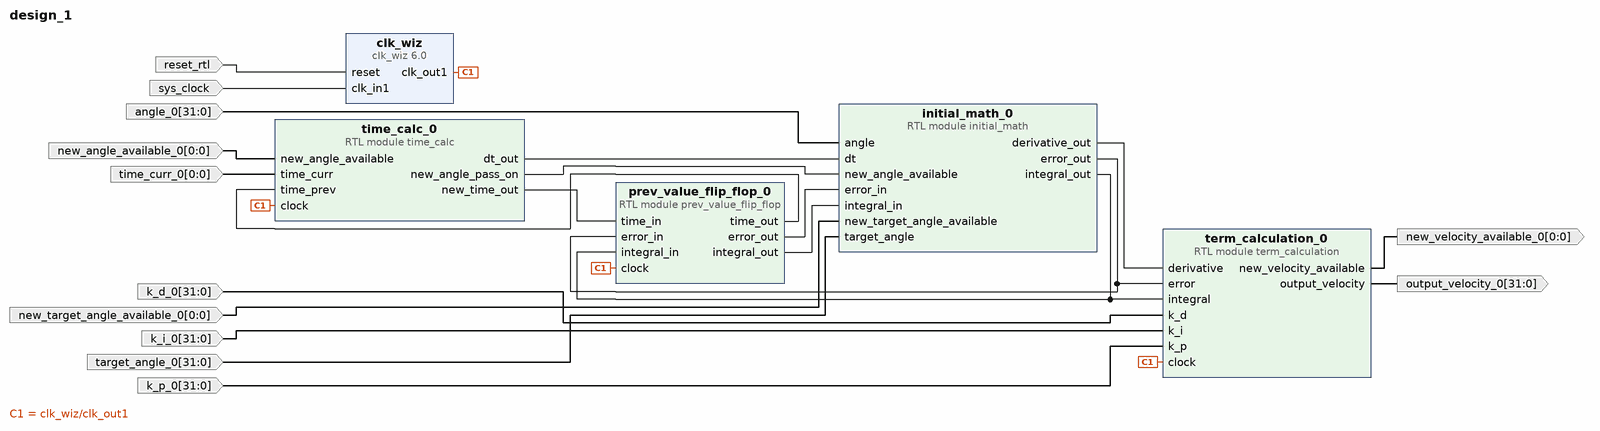
[diagram p0: block diagram of the top level]
# Vivado block design design_1, xc7z020clg400-1, Vivado 2021.1
create_bd_design design_1

create_bd_port -dir I -type clk sys_clock
set_property -dict {CONFIG.FREQ_HZ 125000000 CONFIG.PHASE 0.0} [get_bd_ports sys_clock]
create_bd_port -dir I -type rst reset_rtl
set_property -dict {CONFIG.POLARITY ACTIVE_HIGH} [get_bd_ports reset_rtl]
create_bd_port -dir I -from 31 -to 0 k_i_0
create_bd_port -dir I -from 31 -to 0 k_p_0
create_bd_port -dir I -from 31 -to 0 k_d_0
create_bd_port -dir O -from 31 -to 0 output_velocity_0
create_bd_port -dir I -from 31 -to 0 angle_0
create_bd_port -dir I -from 0 -to 0 new_angle_available_0
create_bd_port -dir O -from 0 -to 0 new_velocity_available_0
create_bd_port -dir I -from 31 -to 0 target_angle_0
create_bd_port -dir I -from 0 -to 0 new_target_angle_available_0
create_bd_port -dir I -from 0 -to 0 time_curr_0

create_bd_cell -type ip -vlnv xilinx.com:ip:clk_wiz:6.0 clk_wiz
set_property -dict {CONFIG.CLK_IN1_BOARD_INTERFACE sys_clock CONFIG.USE_BOARD_FLOW true} [get_bd_cells clk_wiz]
create_bd_cell -type module -reference term_calculation term_calculation_0
create_bd_cell -type module -reference initial_math initial_math_0
create_bd_cell -type module -reference prev_value_flip_flop prev_value_flip_flop_0
create_bd_cell -type module -reference time_calc time_calc_0

# ---- connections ----

connect_bd_net -net angle_0_1 [get_bd_ports angle_0] [get_bd_pins initial_math_0/angle]
connect_bd_net [get_bd_pins clk_wiz/clk_out1] \
  [get_bd_pins term_calculation_0/clock] [get_bd_pins prev_value_flip_flop_0/clock] [get_bd_pins time_calc_0/clock]
connect_bd_net -net initial_math_0_derivative [get_bd_pins initial_math_0/derivative_out] [get_bd_pins term_calculation_0/derivative]
connect_bd_net -net initial_math_0_error [get_bd_pins initial_math_0/error_out] \
  [get_bd_pins term_calculation_0/error] [get_bd_pins prev_value_flip_flop_0/error_in]
connect_bd_net -net initial_math_0_integral [get_bd_pins initial_math_0/integral_out] \
  [get_bd_pins term_calculation_0/integral] [get_bd_pins prev_value_flip_flop_0/integral_in]
connect_bd_net -net k_d_0_1 [get_bd_ports k_d_0] [get_bd_pins term_calculation_0/k_d]
connect_bd_net -net k_i_0_1 [get_bd_ports k_i_0] [get_bd_pins term_calculation_0/k_i]
connect_bd_net -net k_p_0_1 [get_bd_ports k_p_0] [get_bd_pins term_calculation_0/k_p]
connect_bd_net -net new_angle_available_0_1 [get_bd_ports new_angle_available_0] [get_bd_pins time_calc_0/new_angle_available]
connect_bd_net -net new_target_angle_available_0_1 [get_bd_ports new_target_angle_available_0] [get_bd_pins initial_math_0/new_target_angle_available]
connect_bd_net [get_bd_pins prev_value_flip_flop_0/error_out] [get_bd_pins initial_math_0/error_in]
connect_bd_net [get_bd_pins prev_value_flip_flop_0/integral_out] [get_bd_pins initial_math_0/integral_in]
connect_bd_net [get_bd_pins prev_value_flip_flop_0/time_out] [get_bd_pins time_calc_0/time_prev]
connect_bd_net [get_bd_ports reset_rtl] [get_bd_pins clk_wiz/reset]
connect_bd_net [get_bd_ports sys_clock] [get_bd_pins clk_wiz/clk_in1]
connect_bd_net -net target_angle_0_1 [get_bd_ports target_angle_0] [get_bd_pins initial_math_0/target_angle]
connect_bd_net [get_bd_pins term_calculation_0/new_velocity_available] [get_bd_ports new_velocity_available_0]
connect_bd_net [get_bd_pins term_calculation_0/output_velocity] [get_bd_ports output_velocity_0]
connect_bd_net -net time_calc_0_dt [get_bd_pins time_calc_0/dt_out] [get_bd_pins initial_math_0/dt]
connect_bd_net [get_bd_pins time_calc_0/new_angle_pass_on] [get_bd_pins initial_math_0/new_angle_available]
connect_bd_net -net time_calc_0_new_time [get_bd_pins time_calc_0/new_time_out] [get_bd_pins prev_value_flip_flop_0/time_in]
connect_bd_net -net time_curr_0_1 [get_bd_ports time_curr_0] [get_bd_pins time_calc_0/time_curr]

validate_bd_design
save_bd_design
